# Altium schematic sheet System_Architecture.SchDoc: System Architecture
size 279 x 215 mm; CompanyName: Flat Earth Inc.; DrawnBy: Connor Dack; Engineer: Connor Dack; Address1: 985 Technology Blvd; Address2: Suite 102; Address3: Bozeman, MT, 59718; DocumentNumber: 3; Revision: 0.0; SheetNumber: 3; SheetTotal: 11
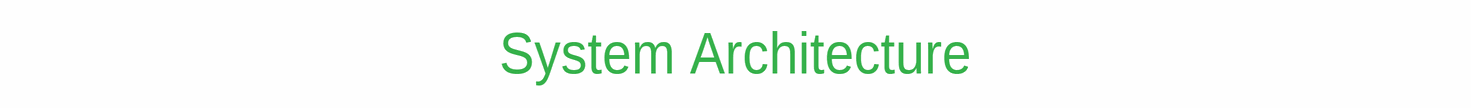
[diagram p0: System_Architecture.SchDoc]

## Notes on the sheet
- System Architecture
- Title:
- Sheet:
- of
- Size:
- 11 x 8.5 Inches
- Rev:
- Date:
- Engineer:
- Time:
- File:
- Copyright 2020 Audio Logic Inc
  THE HARDWARE IS PROVIDED "AS IS", WITHOUT WARRANTY OF ANY KIND, EXPRESS OR IMPLIED, INCLUDING BUT NOT LIMITED TO THE WARRANTIES OF MERCHANTABILITY, FITNESS FOR A PARTICULAR PURPOSE AND NONINFRINGEMENT. IN NO EVENT SHALL THE AUTHORS OR COPYRIGHT HOLDERS BE LIABLE FOR ANY CLAIM, DAMAGES OR OTHER LIABILITY, WHETHER IN AN ACTION OF CONTRACT, TORT OR OTHERWISE, ARISING FROM, OUT OF OR IN CONNECTION WITH THE HARDWARE OR THE USE OR OTHER DEALINGS IN THE HARDWARE.